# EAGLE design piano (EAGLE 6.1)
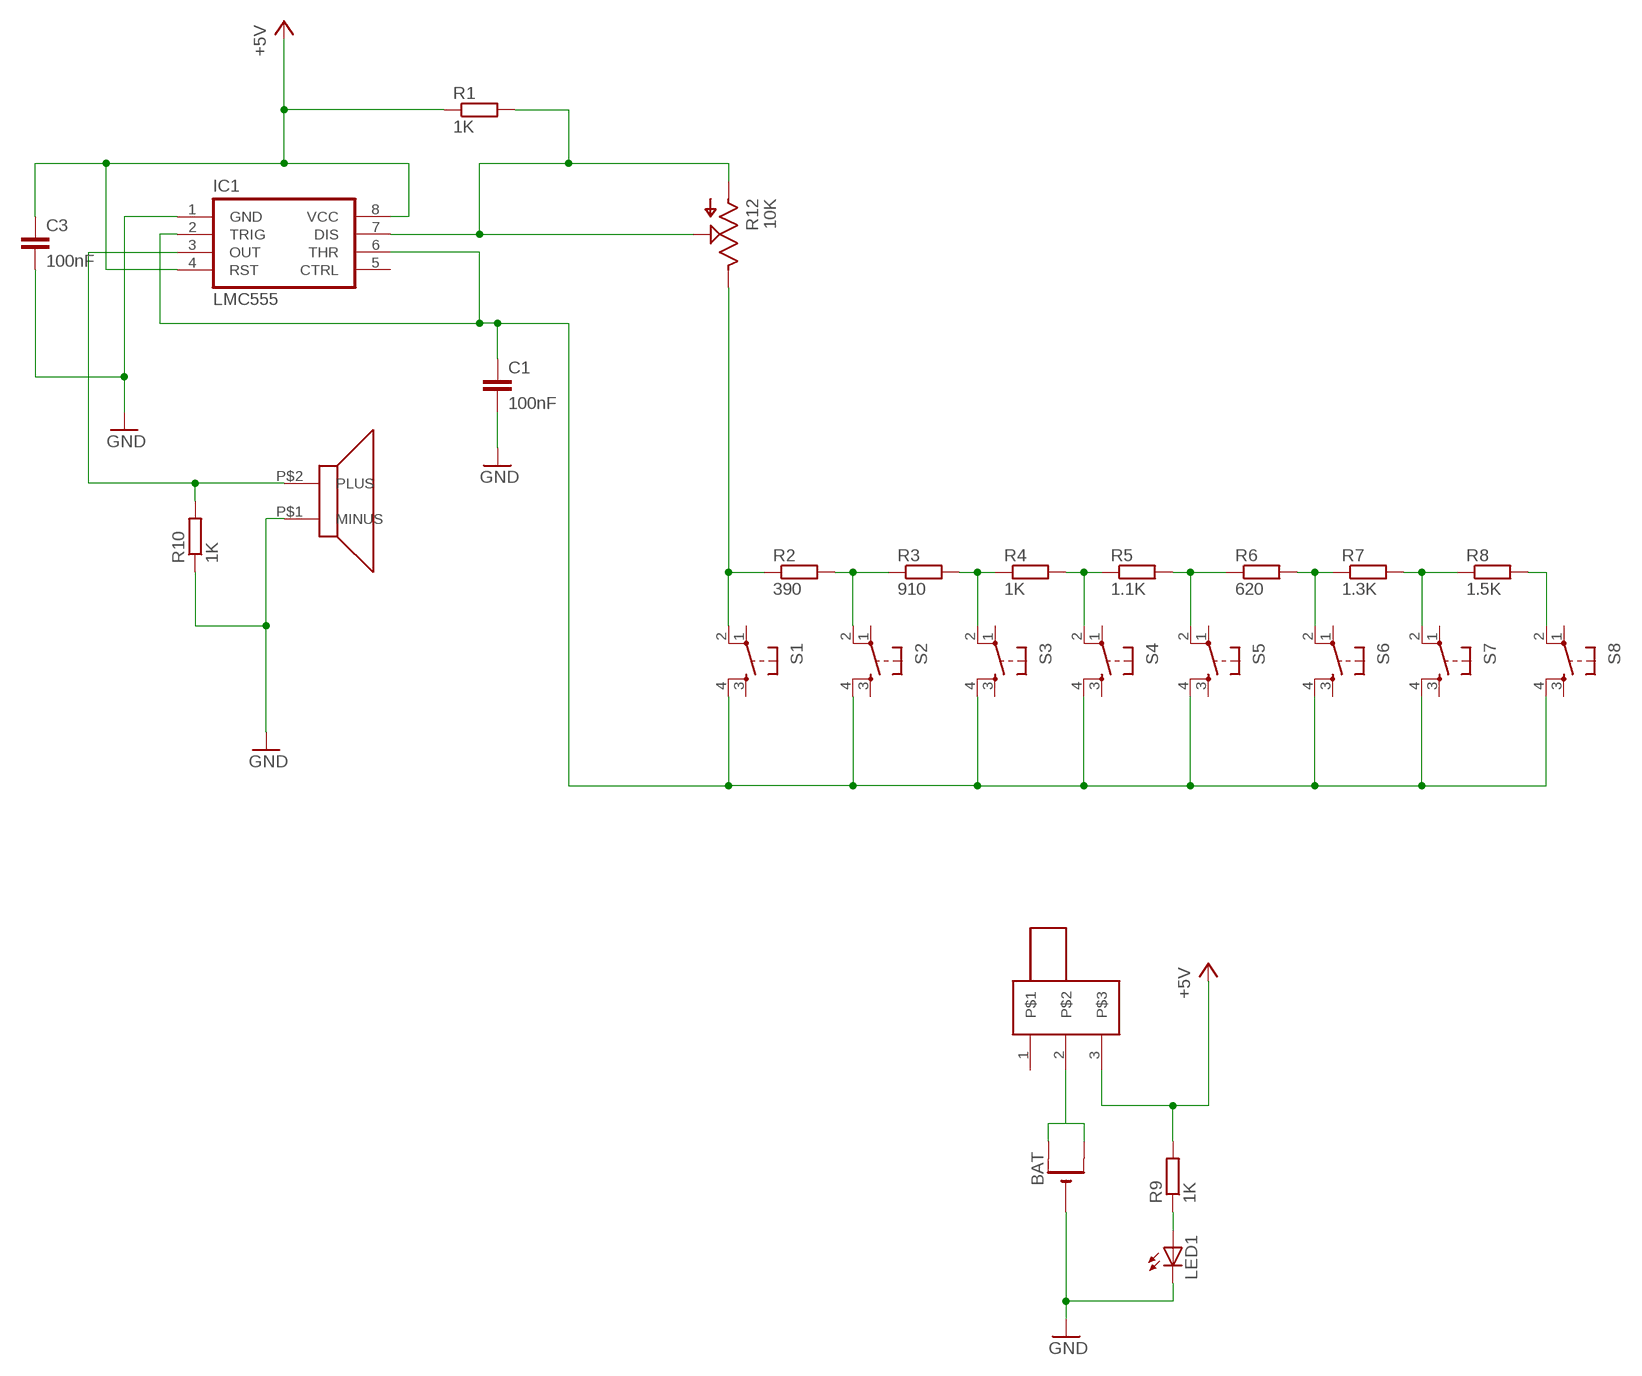
[diagram p0: schematic, sheet 1]

## Parts
BAT  CR1220SMT  [CR1220-SMD]
C1  100nF  C-EUC1206  [C1206]
C3  100nF  C-EUC1206  [C1206]
IC1  LMC555  IC_555-SOIC8  [SOIC-8]
LED1  LED1206  [LED-1206]
R1  1K  R-EU_R1206  [R1206]
R2  390  R-EU_R1206  [R1206]
R3  910  R-EU_R1206  [R1206]
R4  1K  R-EU_R1206  [R1206]
R5  1.1K  R-EU_R1206  [R1206]
R6  620  R-EU_R1206  [R1206]
R7  1.3K  R-EU_R1206  [R1206]
R8  1.5K  R-EU_R1206  [R1206]
R9  1K  R-EU_R1206  [R1206]
R10  1K  R-EU_R1206  [R1206]
R12  10K  PVZ3A  [PVZ3A]
S1  TAC_SWITCHSMD  [TACTILE_SWITCH_SMD]
S2  TAC_SWITCHSMD  [TACTILE_SWITCH_SMD]
S3  TAC_SWITCHSMD  [TACTILE_SWITCH_SMD]
S4  TAC_SWITCHSMD  [TACTILE_SWITCH_SMD]
S5  TAC_SWITCHSMD  [TACTILE_SWITCH_SMD]
S6  TAC_SWITCHSMD  [TACTILE_SWITCH_SMD]
S7  TAC_SWITCHSMD  [TACTILE_SWITCH_SMD]
S8  TAC_SWITCHSMD  [TACTILE_SWITCH_SMD]
U$1  SMD-100030H-05052T  [SMD-100030H]
U$2  SK12D07VG3  SWITCH3  [SWITCH3]

## Nets
+5V: C3.1 IC1.4(RST) IC1.8(VCC) R1.1 R9.2 U$2.3
GND: BAT.- C1.2 C3.2 IC1.1(GND) LED1.C R10.1 U$1.P$1(MINUS)
N$1: R2.1 R12.P$3 S1.2
N$2: R2.2 R3.1 S2.2
N$3: R3.2 R4.1 S3.2
N$4: R4.2 R5.1 S4.2
N$5: IC1.7(DIS) R1.2 R12.P$1 R12.P$2
N$6: R5.2 R6.1 S5.2
N$8: IC1.3(OUT) R10.2 U$1.P$2(PLUS)
N$9: C1.1 IC1.2(TRIG) IC1.6(THR) S1.4 S2.4 S3.4 S4.4 S5.4 S6.4 S7.4 S8.4
N$10: R6.2 R7.1 S6.2
N$11: R7.2 R8.1 S7.2
N$12: R8.2 S8.2
N$13: BAT.+$1(+) BAT.+$2(+1) U$2.2
N$14: LED1.A R9.1
Unconnected: IC1.5(CTRL) S1.1 S1.3 S2.1 S2.3 S3.1 S3.3 S4.1 S4.3 S5.1 S5.3 S6.1 S6.3 S7.1 S7.3 S8.1 S8.3 U$2.1

## Library data of the parts
BAT = adafruit:CR1220: CR1216/CR1220/CR1225 12mm 3V lithium coin cell Great for battery packup. Both SMT and THM holders. Note the THM package has the ground pads on both sides of the PCB so that the masks are the same - this reduces the cost
C1 C3 = resistor:C-EU: CAPACITOR, European symbol
IC1 = dp_devices:IC_555: Classic 555 IC
LED1 = SparkFun-LED:LED: LEDs Standard schematic elements and footprints for 5mm, 3mm, 1206, and 0603 sized LEDs. 5mm - Spark Fun Electronics SKU : COM-00529 (and others)
R1-R10 = resistor:R-EU_: RESISTOR, European symbol
R12 = shinythings:PVZ3A
S1-S8 = SparkFun-Electromechanical:TAC_SWITCH: Momentary Switch Button commonly used for reset or general input. Spark Fun Electronics SKU : COM-00097 SMT- SWCH-08247; PROD_ID: SWCH-08247
U$1 = Elements:SMD-100030H-05052T
U$2 = SashaLib:SWITCH3: SK12D07VG3

## Board
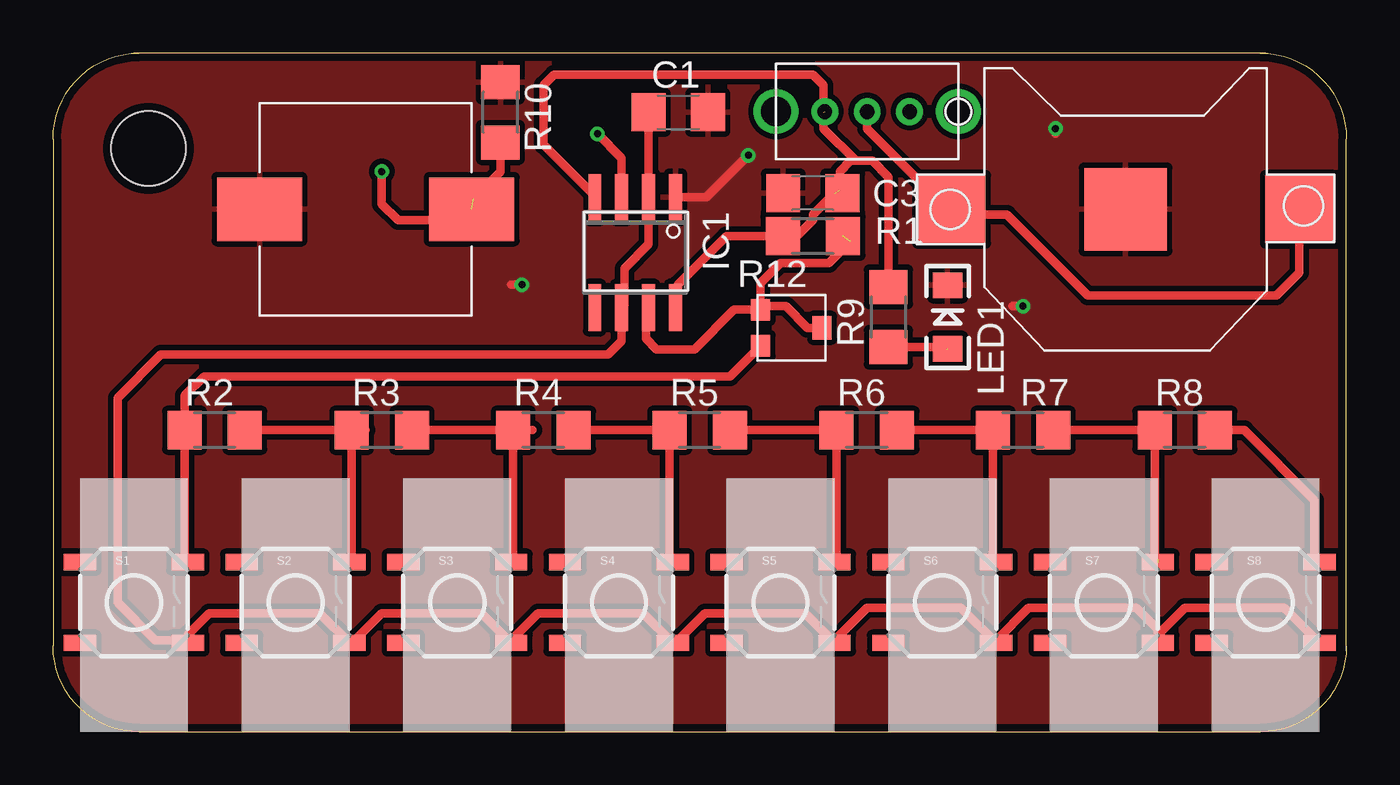
[diagram p1: board, top side]
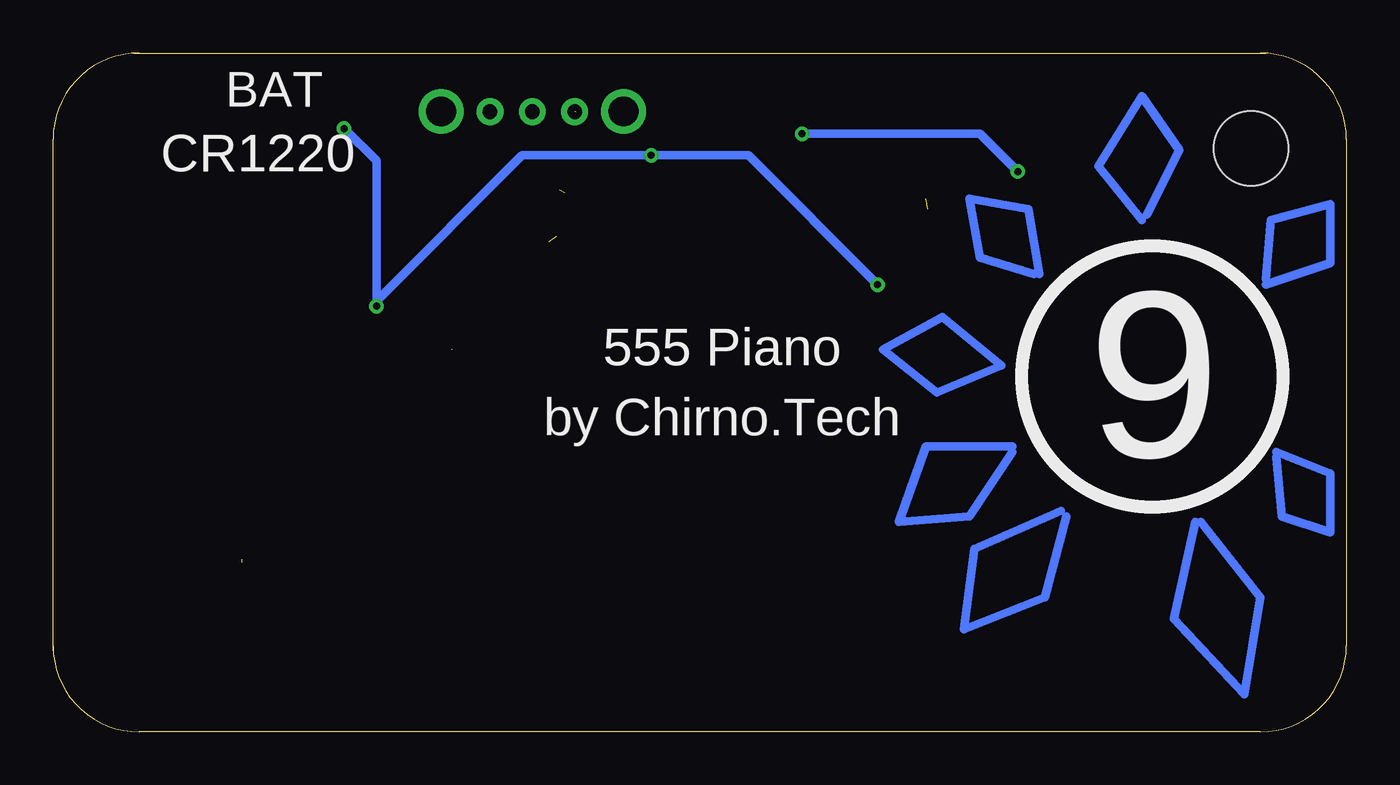
[diagram p2: board, bottom side, seen from below]

Size 60.96 x 32 mm. Coordinates in mm from the lower left corner, seen from the top.
Outline: 60.96,3.81 60.96,27.94 arc90 56.9,32
Outline: 57.15,32 3.81,32
Outline: 60.96,4.06 arc-90 56.9,0 4.06,0 arc-90 0,4.06 0,27.94 arc-90 4.06,32
Copper layers (1*16): Top 0.0356mm / dielectric 1.5011mm / Bottom 0.0356mm
Design rules: minimum track width 6mil, minimum drill 13mil, track to track 6mil, track to pad 6mil, pad to pad 6mil, via to via 6mil, smd to smd 6mil, copper to edge 15mil, drill to drill 6mil, minimum pad ring 7mil, minimum via ring 7mil, stop-mask expansion 2.5mil, vias tented up to drill 1mm, thermal gap 10mil
Holes 3.5 mm at 4.5,27.5

### Footprints (pad centres in the part's own frame; a part is rotated, then mirrored left to right if it is on the bottom)
CR1220-SMD = smd 3.2 x 3.2: +$1 -8.2,0; +$2 8.2,0 | smd 3.9 x 3.9: - 0,0
C1206 = smd 1.6 x 1.8: 1 -1.4,0; 2 1.4,0
SOIC-8 = smd 0.6 x 2.2: 1 -1.905,-2.6; 2 -0.635,-2.6; 3 0.635,-2.6; 4 1.905,-2.6; 5 1.905,2.6; 6 0.635,2.6; 7 -0.635,2.6; 8 -1.905,2.6
LED-1206 = smd 1.2 x 1.4: A -1.5,0; C 1.5,0
R1206 = smd 1.6 x 1.803: 1 -1.422,0; 2 1.422,0
PVZ3A = smd 1 x 0.9: P$1 -0.85,-1.45; P$3 0.85,-1.45 | smd 1.1 x 0.9: P$2 0,1.45
TACTILE_SWITCH_SMD = smd 1.524 x 0.762: 1 -2.54,1.905; 2 2.54,1.905; 3 -2.54,-1.905; 4 2.54,-1.905
SMD-100030H = smd 4 x 3: P$1 -5,0; P$2 5,0
SWITCH3 = drill 0.7 pad 1.27: 1 2.3,2.25; 2 4.3,2.25; 3 6.3,2.25 | drill 1.4: NC 0,2.25; NC1 8.6,2.25

### Placement (x,y rotation side)
BAT  50.55,24.64 0 top
C1  29.46,29.21 0 top
C3  35.81,25.4 180 top
IC1  27.43,22.61 180 top
LED1  42.16,19.56 90 top
R1  35.81,23.37 0 top
R2  7.62,14.22 0 top
R3  15.49,14.22 0 top
R4  23.11,14.22 0 top
R5  30.48,14.22 0 top
R6  38.35,14.22 0 top
R7  45.72,14.22 0 top
R8  53.34,14.22 0 top
R9  39.37,19.56 90 top
R10  21.08,29.21 270 top
R12  34.8,19.05 270 top
S1  3.81,6.1 0 top
S2  11.43,6.1 0 top
S3  19.05,6.1 0 top
S4  26.67,6.1 0 top
S5  34.29,6.1 0 top
S6  41.91,6.1 0 top
S7  49.53,6.1 0 top
S8  57.15,6.1 0 top
U$1  14.73,24.64 0 top
U$2  42.67,31.5 180 top

### Tracks (layer width: path | path; a pad name or v marks a point on that pad's centre or on a via)
+5V  (2 unrouted)
  Top 0.406: IC1.8 29.46,20.13 29.46,21.08 31.75,23.37 R1.1 35.05,23.37 35.81,24.13 35.81,24.38 36.83,25.4 | R9.2 39.37,26.16 38.61,26.92 | IC1.4 25.53,25.27 23.11,27.69 23.11,30.48 23.62,30.99 34.8,30.99 35.81,30.99 36.32,30.48 36.32,29.21 36.32,28.96 | 36.32,28.7 36.32,28.96 | 38.61,26.92 37.85,26.92 36.32,28.45 36.32,28.96 | 38.61,26.92 37.59,26.92 37.08,26.42 37.08,25.53 C3.1
GND  (via drill 0.33)
  Top 0.406: IC1.1 30.79,25.21 v32.77,27.18 | v22.1,21.08 21.59,21.08 | v45.72,20.07 45.21,20.07 | v47.24,28.45 47.24,28.19
  Bottom 0.406: v22.1,21.08 28.19,27.18 v32.77,27.18 38.61,27.18 38.86,27.18 45.72,20.32 | 45.72,20.32 v45.72,20.07 | 45.72,20.32 45.72,26.92 v47.24,28.45
  pour Top (isolate 0.254): -1.02,33.53 62.48,33.53 62.48,-1.52 -1.02,-1.52
N$1
  Top 0.406: S1.2 6.2,8.15 R2.1 6.2,15.85 7.11,16.76 31.91,16.76 R12.P$3
N$2
  Top 0.406: R2.2 R3.1 | R3.1 14.73,14.22 R3.1 | R3.1 14.07,8.1 S2.2
N$3
  Top 0.406: R3.2 R4.1 | R4.1 22.61,14.22 R4.1 | R4.1 21.69,8.1 S3.2
N$4
  Top 0.406: R4.2 R5.1 29.06,8.15 S4.2
N$5  (1 unrouted)
  Top 0.406: R12.P$1 32.09,19.9 30.23,18.03 28.45,18.03 27.94,18.54 27.94,19.88 IC1.7 | R12.P$2 35.56,19.05 34.54,20.07 33.51,20.07 R12.P$1 | R12.P$1 33.35,21.16 34.29,22.1 36.58,22.1 37.59,23.11
N$6
  Top 0.406: R5.2 R6.1 36.93,8.1 S5.2
N$7
  Bottom 0.406: 6.86,9.91 4.06,6.35 4.83,1.78 8.13,5.33 7.11,9.91
N$8  (via drill 0.33)  (1 unrouted)
  Top 0.406: IC1.3 26.8,26.7 26.8,27.05 v25.65,28.19 | R10.2 21.08,26.42 19.81,25.15 | v15.49,26.42 15.49,24.89 16.26,24.13 19.22,24.13 U$1.P$2
  Bottom 0.406: v25.65,28.19 17.27,28.19 v15.49,26.42
N$9
  Top 0.406: C1.1 IC1.2 28.07,22.99 26.92,21.84 26.92,20.13 IC1.6 26.8,18.41 26.16,17.78 5.08,17.78 3.05,15.75 3.05,6.1 4.83,4.32 6.22,4.32 S1.4 6.35,4.57 7.37,5.59 12.57,5.59 S2.4 14.1,4.19 15.49,5.59 20.19,5.59 S3.4 21.59,4.32 22.86,5.59 27.81,5.59 S4.4 29.34,4.19 30.73,5.59 35.43,5.59 S5.4 36.83,4.32 38.35,5.84 42.8,5.84 S6.4 44.45,4.32 45.97,5.84 51.05,5.84 52.07,4.83 S7.4 52.07,4.57 53.34,5.84 58.04,5.84 S8.4
N$10
  Top 0.406: R6.2 R7.1 44.3,8.15 S6.2
N$11  (1 unrouted)
  Top 0.406: R7.2 51.66,14.22 R8.1 51.92,8.28 52.07,8.13
N$12
  Top 0.406: R8.2 56.13,14.22 59.44,10.92 59.44,8.26 S8.2
N$13
  Top 0.406: U$2.2 38.35,29.23 38.35,28.45 42.16,24.64 BAT.+$1 42.6,24.38 44.96,24.38 48.77,20.57 57.66,20.57 58.75,21.66 BAT.+$2
N$14  (1 unrouted)
  Top 0.406: R9.1 42.06,18.14 42.16,18.03
N$15
  Bottom 0.406: 13.21,10.16 14.22,6.35 18.03,4.83 17.53,8.64 13.46,10.41
N$16
  Bottom 0.406: 9.65,24.13 11.68,26.67 9.65,29.97 7.87,27.43 9.4,24.38
N$17
  Bottom 0.406: 3.81,21.34 3.56,24.13 0.76,24.89 0.76,22.1 3.81,21.08
N$18
  Bottom 0.406: 16.26,17.27 19.3,16 21.84,18.03 19.05,19.56 16.26,17.27
N$19
  Bottom 0.406: 14.73,21.59 17.27,22.35 17.78,25.15 14.99,24.64 14.48,21.59
N$20
  Bottom 0.406: 3.3,12.95 3.05,10.16 0.76,9.4 0.76,12.19 3.3,13.21
N$21
  Bottom 0.406: 15.75,13.21 17.78,10.16 21.08,9.91 19.81,13.46 15.75,13.46

### Text on the board
bPlace: 555 Piano | by Chirno.Tech | 9
bNames: CR1220